# EAGLE schematic bwlMotorSpeed (EAGLE 6.4)
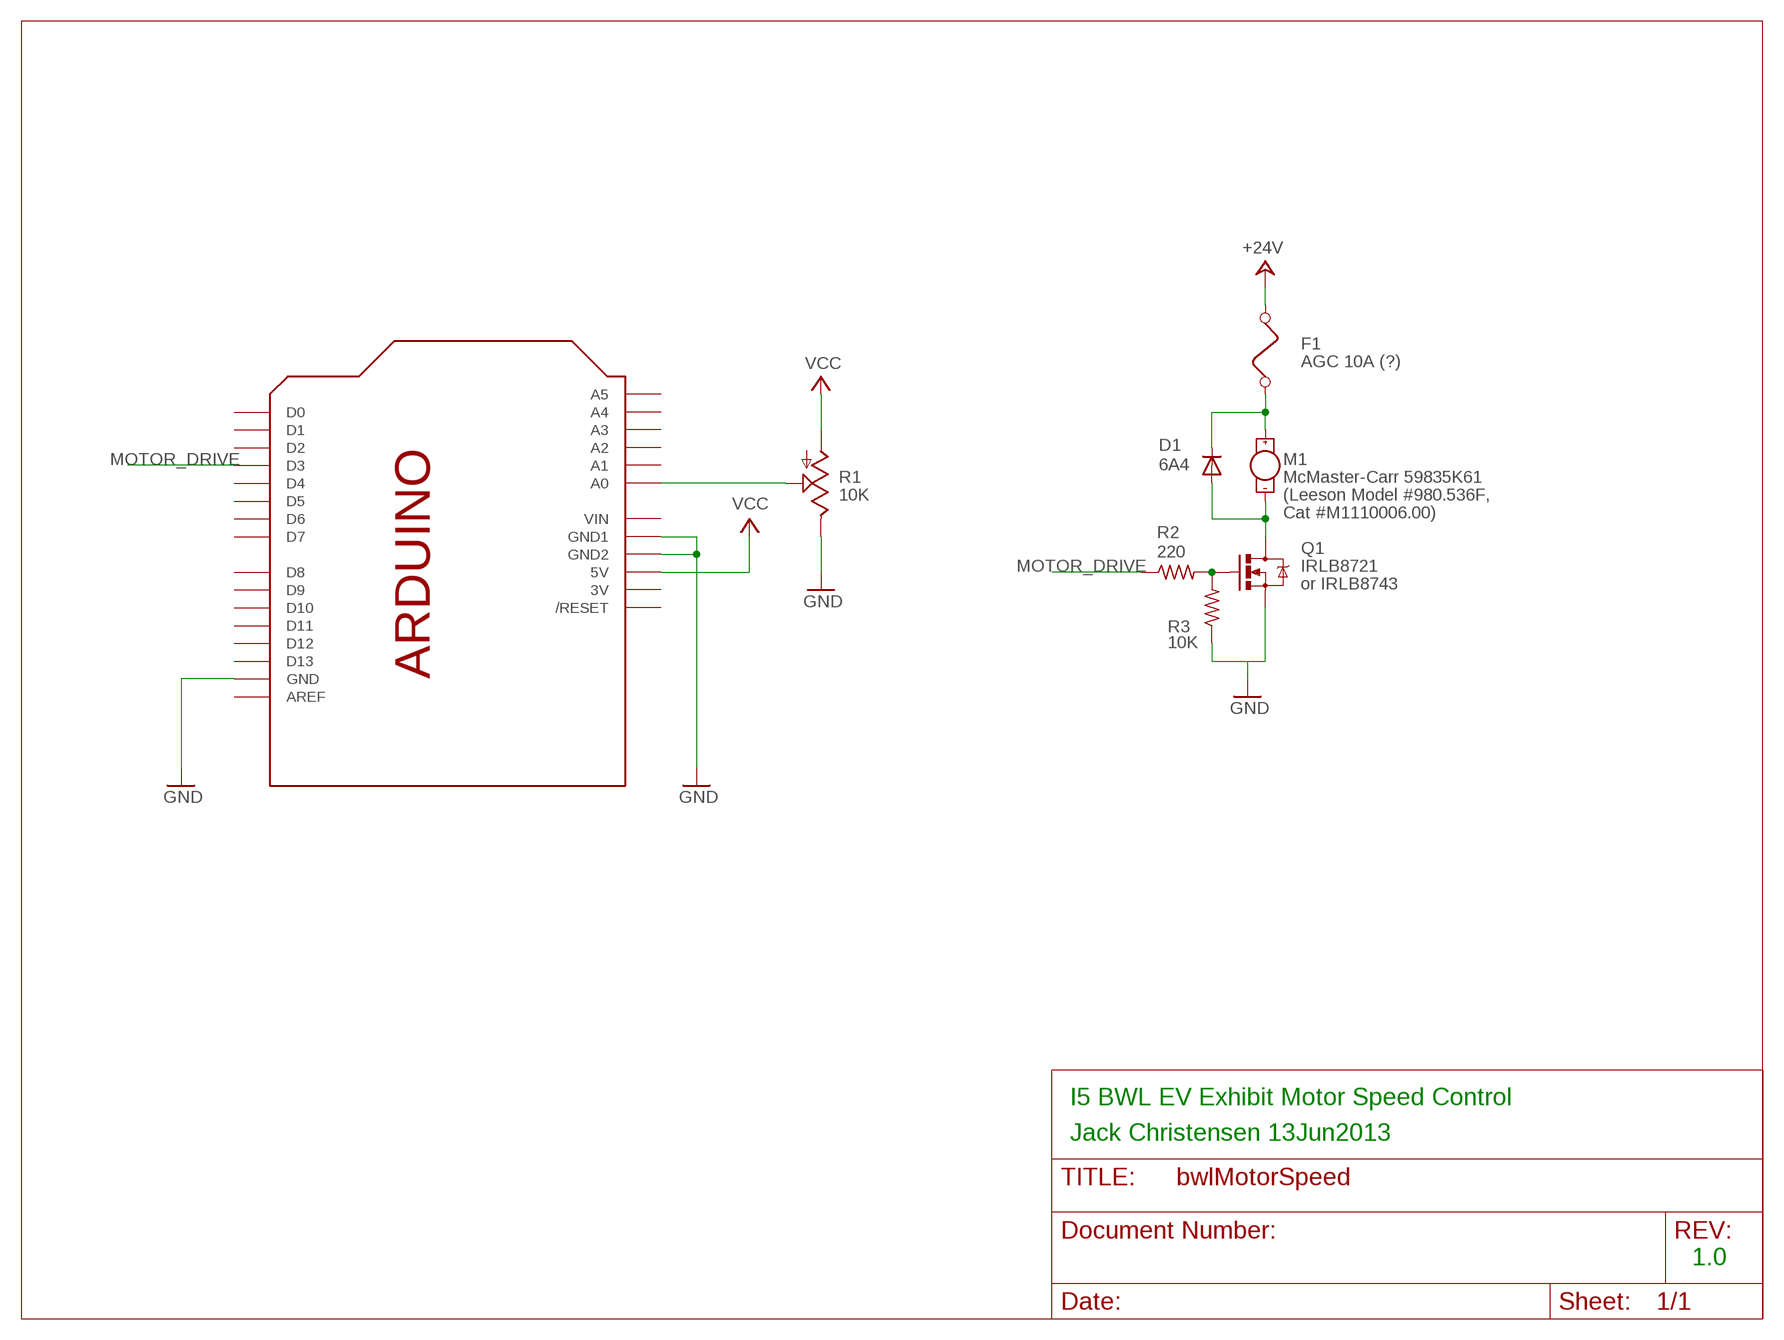
[diagram p0: schematic, sheet 1]

## Parts
D1  6A4  DIODE1N400X  [1N400X]
F1  AGC 10A (?)  FUSE  [FUSE]
M1  McMaster-Carr 59835K61  MOTOR10MM  [VIBE-MOTOR-10MM]
Q1  IRLB8721  MOSFET-NCHANNELPTH  [TO-92]
R1  10K  TRIMPOT-3386P3386P  [TRIMPOT-3386P]
R2  220  R-US_M0805  [M0805]
R3  10K  R-US_M0805  [M0805]
U$1  ARDUINOUNO  [ARDUINO]

## Nets
+24V: F1.2
GND: Q1.2(S) R1.1(E) R3.1 U$1.GND U$1.GND1 U$1.GND2
MOTOR_DRIVE: R2.1 U$1.D3
N$1: R1.2(S) U$1.A0
N$2: D1.A M1.- Q1.1(D)
N$4: Q1.3(G) R2.2 R3.2
N$6: D1.K F1.1 M1.+
VCC: R1.3(A) U$1.5V
Unconnected: U$1.A1 U$1.A2 U$1.A3 U$1.A4 U$1.A5 U$1.AREF U$1.D0 U$1.D1 U$1.D2 U$1.D4 U$1.D5 U$1.D6 U$1.D7 U$1.D8 U$1.D9 U$1.D10 U$1.D11 U$1.D12 U$1.D13 U$1.RESET(/RESET)

## Notes on the sheet
- (Leeson Model #980.536F,
- Cat #M1110006.00)
- or IRLB8743
- I5 BWL EV Exhibit Motor Speed Control
- Jack Christensen 13Jun2013
- 1.0

## Power pins joined to a net without a drawn wire
3V: U$1.3V
VIN: U$1.VIN

## Library data of the parts
D1 = _jc:DIODE
F1 = special:FUSE: FUSE 5 x 20 mm
M1 = SparkFun:MOTOR: Vibration Motor Physical dimension and wire connections for this powerful vibration motor. Motor has a self adhesive backing. Spark Fun Electronics SKU : ROB-08449
Q1 = _jc:MOSFET-NCHANNEL
R1 = _jc:TRIMPOT-3386P
R2 R3 = _jc:R-US_: RESISTOR, American symbol
U$1 = adafruit:ARDUINO: Arduino Diecimila/Duemilanove Make a shield with ease, this package has all the named pins as well as the two mounting drill holes and an outline of the USB and DC power connector. The outline is on the DIMENSION layer, so if your board house uses it they will cut the outline to match. http://www.ladyada.net/library/pcb/eaglelibrary.html